# Altium project OPL2LPT Replica.PrjPcb
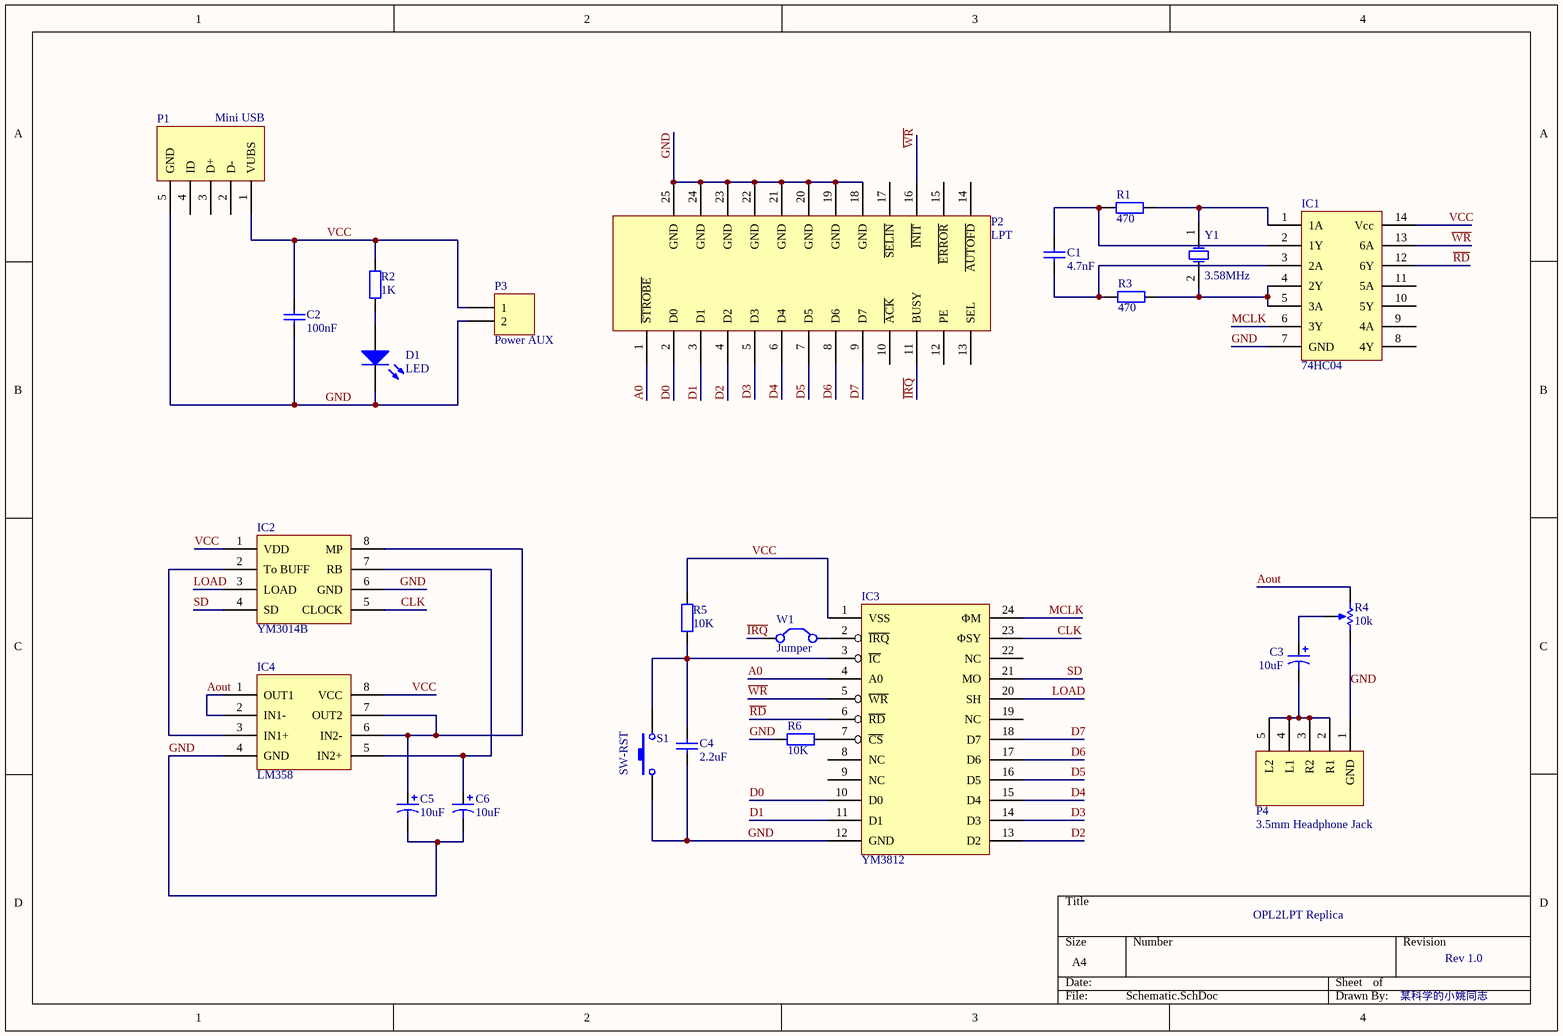
[diagram p0: Schematic.SchDoc]
1 sheet, 24 parts. Net scope: global (net labels, ports and power ports of the same name join across sheets).
Board file: PCB.PcbDoc

## Sheet Schematic.SchDoc
size A4

### Parts
C1  4.7nF  [MLCC]
C2  100nF  [MLCC]
C3  10uF  [CAP 2.0*5*11 - BK]
C4  2.2uF  [MLCC]
C5  10uF  [CAP 2.0*5*11 - BK]
C6  10uF  [CAP 2.0*5*11 - BK]
D1  LED  [LED 3MM-G]
IC1  74HC04  [DIP14-300_MH]
IC2  YM3014B  [DIP8-300_MH]
IC3  YM3812  [DIP24-600_MH]
IC4  LM358  [DIP8-300_MH]
P1  Mini USB  [Mini USB]
P2  LPT  [DB25(DR252M)]
P3  Power AUX  [HDR2.54-LI-2P]
P4  3.5mm Headphone Jack  [3F07_BK]
R1  470  [RS 1/4W]
R2  1K  [RS 1/4W]
R3  470  [RS 1/4W]
R4  10k  [WH148-1-G15]
R5  10K  [RS 1/4W]
R6  10K  [RS 1/4W]
S1  SW-RST  [TSW DIP-6*6*11]
W1  Jumper  [HDR2.54-LI-2P]
Y1  3.58MHz  [OSC HC-49S]

### Nets
A0: IC3.4(A0) P2.1(~{STROBE})
Aout: IC4.1(OUT1) IC4.2(IN1-) R4.1(TOP)
CLK: IC2.5(CLOCK) IC3.23(ΦSY)
D0: IC3.10(D0) P2.2(D0)
D1: IC3.11(D1) P2.3(D1)
D2: IC3.13(D2) P2.4(D2)
D3: IC3.14(D3) P2.5(D3)
D4: IC3.15(D4) P2.6(D4)
D5: IC3.16(D5) P2.7(D5)
D6: IC3.17(D6) P2.8(D6)
D7: IC3.18(D7) P2.9(D7)
GND: C2.1 C4.1 C5.2 C6.2 D1.2(K) IC1.7(GND) IC2.6(GND) IC3.12(GND) IC4.4(GND) P1.5(GND) P2.18(GND) P2.19(GND) P2.20(GND) P2.21(GND) P2.22(GND) P2.23(GND) P2.24(GND) P2.25(GND) P3.2 P4.1(GND) R4.2(BOT) R6.1 S1.1
~{IRQ}: P2.11(BUSY) W1.1(C1)
LOAD: IC2.3(LOAD) IC3.20(SH)
MCLK: IC1.6(3Y) IC3.24(ΦM)
~{RD}: IC1.12(6Y) IC3.6(~{RD})
SD: IC2.4(SD) IC3.21(MO)
VCC: C2.2 IC1.14(Vcc) IC2.1(VDD) IC3.1(VSS) IC4.8(VCC) P1.1(VUBS) P3.1 R2.2 R5.1
~{WR}: IC1.13(6A) IC3.5(~{WR}) P2.16(~{INIT})
NetC1_1: C1.1 IC1.3(2A) R3.1
NetC1_2: C1.2 IC1.2(1Y) R1.1
NetC3_1: C3.1 R4.3(TAP)
NetC3_2: C3.2 P4.2(R1) P4.3(R2) P4.4(L1) P4.5(L2)
NetC4_2: C4.2 IC3.3(~{IC}) R5.2 S1.2
NetC5_1: C5.1 IC2.8(MP) IC4.6(IN2-) IC4.7(OUT2)
NetC6_1: C6.1 IC2.7(RB) IC4.5(IN2+)
NetD1_1: D1.1(A) R2.1
NetIC1_1: IC1.1(1A) R1.2 Y1.1(OSC1)
NetIC1_4: IC1.4(2Y) IC1.5(3A) R3.2 Y1.2(OSC2)
NetIC2_2: IC2.2(To_BUFF) IC4.3(IN1+)
NetIC3_2: IC3.2(~{IRQ}) W1.2(C2)
NetIC3_7: IC3.7(~{CS}) R6.2

Not connected (* = marked no-connect by the designer): IC1 8(4Y) 9(4A) 10(5Y) 11(5A); IC3 8(NC) 9(NC) 19(NC) 22(NC); P1 2(D-) 3(D+) 4(ID); P2 10(~{ACK}) 12(PE) 13(SEL) 14(~{AUTOFD}) 15(~{ERROR}) 17(~{SELIN})

### Notes on the sheet
- OPL2LPT Replica
- Rev 1.0
- 某科学的小姚同志

### Library data of the parts
C1 C2 C4 = Cap Semi: Capacitor (Semiconductor SIM Model); pin to pad: 1>0 2>1
C3 C5 C6 = Cap Pol3: Polarized Capacitor (Surface Mount)
D1 = LED2: Typical RED, GREEN, YELLOW, AMBER GaAs LED
IC1 = 7404
P3 = Header 2: Header, 2-Pin
R1-R3 R5 R6 = Res2: Resistor
R4 = RPot: Potentiometer; pin to pad: 1>3 2>1 3>2
S1 = SW-PB: Switch
W1 = Jumper: Jumper Wire
Y1 = XTAL: Crystal Oscillator